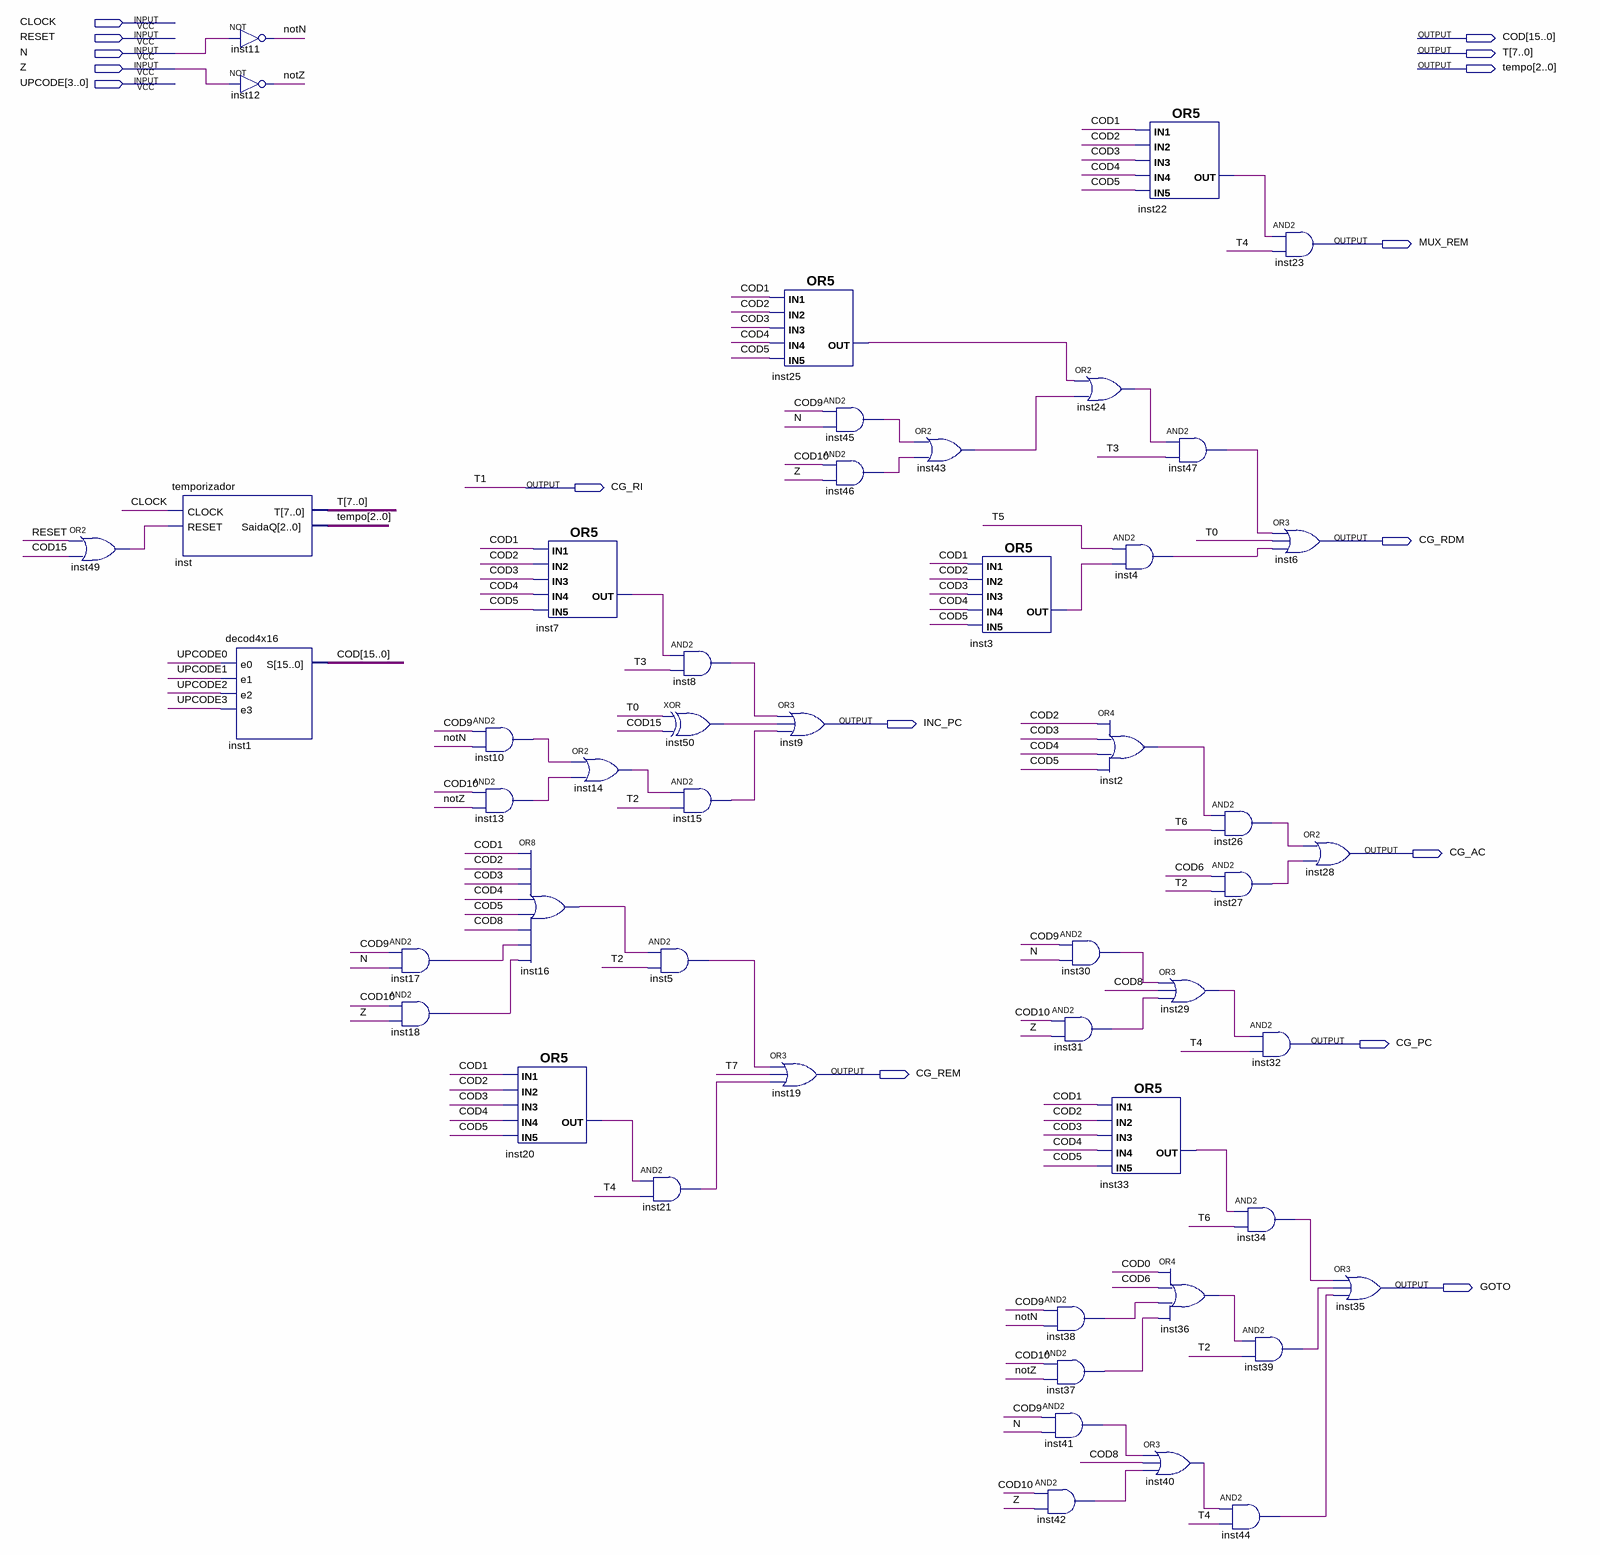
[diagram p0: schematic sheet]
// Quartus schematic controlador.bdf as structural Verilog: 50 symbols, 16 pins
module controlador (
  input  CLOCK,
  input  RESET,
  input  N,
  input  Z,
  input  [3:0] UPCODE,
  output [15:0] COD,
  output [7:0] T,
  output [2:0] tempo,
  output MUX_REM,
  output CG_RI,
  output CG_RDM,
  output INC_PC,
  output CG_AC,
  output CG_PC,
  output CG_REM,
  output GOTO
);

  wire inst2_out, inst3_out, inst4_out, inst5_out, inst7_out, inst8_out, inst10_out, inst13_out, inst14_out,
       inst15_out, inst16_out, inst17_out, inst18_out, inst20_out, inst21_out, inst22_out, inst24_out,
       inst25_out, inst26_out, inst27_out, inst29_out, inst30_out, inst31_out, inst33_out, inst34_out,
       inst36_out, inst37_out, inst38_out, inst39_out, inst40_out, inst41_out, inst42_out, inst43_out,
       inst44_out, inst45_out, inst46_out, inst47_out, inst49_out, inst50_out, notN, notZ;

  or inst49 (inst49_out, RESET, COD[15]);
  temporizador inst (.CLOCK(CLOCK), .RESET(inst49_out), .T({T[7:2], CG_RI, T[0]}), .SaidaQ(tempo));
  not inst11 (notN, N);
  not inst12 (notZ, Z);
  decod4x16 inst1 (.e0(UPCODE[0]), .e1(UPCODE[1]), .e2(UPCODE[2]), .e3(UPCODE[3]), .S(COD));
  and inst17 (inst17_out, COD[9], N);
  and inst18 (inst18_out, COD[10], Z);
  and inst10 (inst10_out, COD[9], notN);
  and inst13 (inst13_out, COD[10], notZ);
  or inst20 (inst20_out, COD[1], COD[2], COD[3], COD[4], COD[5]);
  or inst7 (inst7_out, COD[1], COD[2], COD[3], COD[4], COD[5]);
  or inst14 (inst14_out, inst10_out, inst13_out);
  or inst16 (inst16_out, COD[1], COD[2], COD[3], COD[4], COD[5], COD[8], inst17_out, inst18_out);
  and inst8 (inst8_out, inst7_out, T[3]);
  xor inst50 (inst50_out, T[0], COD[15]);
  and inst15 (inst15_out, inst14_out, T[2]);
  and inst5 (inst5_out, inst16_out, T[2]);
  and inst21 (inst21_out, inst20_out, T[4]);
  or inst25 (inst25_out, COD[1], COD[2], COD[3], COD[4], COD[5]);
  or inst9 (INC_PC, inst8_out, inst50_out, inst15_out);
  or inst19 (CG_REM, inst5_out, T[7], inst21_out);
  and inst45 (inst45_out, COD[9], N);
  and inst46 (inst46_out, COD[10], Z);
  or inst43 (inst43_out, inst45_out, inst46_out);
  or inst3 (inst3_out, COD[1], COD[2], COD[3], COD[4], COD[5]);
  and inst30 (inst30_out, COD[9], N);
  and inst31 (inst31_out, COD[10], Z);
  and inst38 (inst38_out, COD[9], notN);
  and inst37 (inst37_out, COD[10], notZ);
  and inst41 (inst41_out, COD[9], N);
  and inst42 (inst42_out, COD[10], Z);
  or inst24 (inst24_out, inst25_out, inst43_out);
  and inst4 (inst4_out, T[5], inst3_out);
  or inst2 (inst2_out, COD[2], COD[3], COD[4], COD[5]);
  or inst33 (inst33_out, COD[1], COD[2], COD[3], COD[4], COD[5]);
  or inst22 (inst22_out, COD[1], COD[2], COD[3], COD[4], COD[5]);
  and inst47 (inst47_out, inst24_out, T[3]);
  or inst29 (inst29_out, inst30_out, COD[8], inst31_out);
  or inst36 (inst36_out, COD[0], COD[6], inst38_out, inst37_out);
  or inst40 (inst40_out, inst41_out, COD[8], inst42_out);
  and inst26 (inst26_out, inst2_out, T[6]);
  and inst27 (inst27_out, COD[6], T[2]);
  and inst34 (inst34_out, inst33_out, T[6]);
  and inst39 (inst39_out, inst36_out, T[2]);
  and inst44 (inst44_out, inst40_out, T[4]);
  and inst23 (MUX_REM, inst22_out, T[4]);
  or inst6 (CG_RDM, inst47_out, T[0], inst4_out);
  or inst28 (CG_AC, inst26_out, inst27_out);
  and inst32 (CG_PC, inst29_out, T[4]);
  or inst35 (GOTO, inst34_out, inst39_out, inst44_out);

  assign T[1] = CG_RI;

  // Other names for the same wires on the sheet: T1 = CG_RI
endmodule
